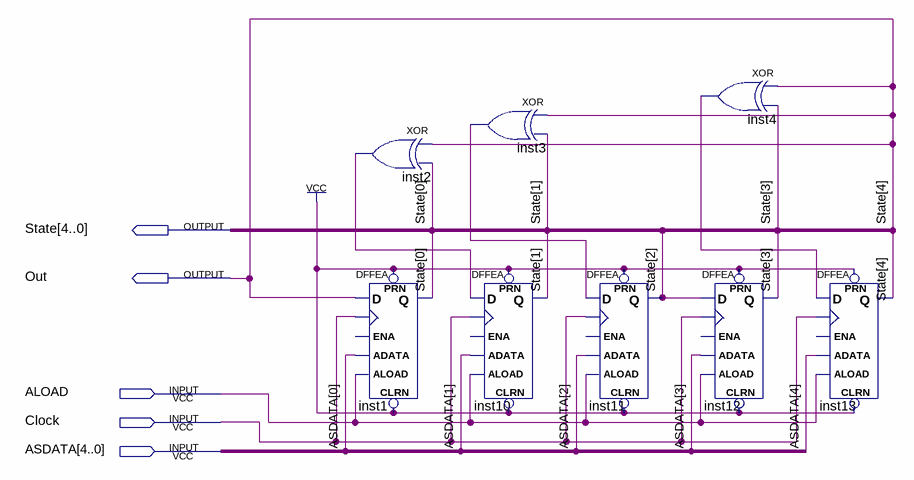
[diagram p0: schematic sheet]
// Quartus schematic MGeneratorInConnect.bdf as structural Verilog: 8 symbols, 5 pins
module MGeneratorInConnect (
  input  ALOAD,
  input  Clock,
  input  [4:0] ASDATA,
  output [4:0] State,
  output Out
);

  wire inst2_out, inst3_out, inst4_out;

  xor inst2 (inst2_out, Out, State[0]);
  DFFEA inst1 (
    .PRN(1'b1), .ALOAD(ALOAD), .ADATA(ASDATA[0]), .CLK(Clock), .D(Out), .CLRN(1'b1), .Q(State[0]));  // open: ENA
  xor inst3 (inst3_out, Out, State[1]);
  DFFEA inst10 (
    .PRN(1'b1), .ALOAD(ALOAD), .ADATA(ASDATA[1]), .CLK(Clock), .D(inst2_out), .CLRN(1'b1), .Q(State[1]));  // open: ENA
  DFFEA inst11 (
    .PRN(1'b1), .ALOAD(ALOAD), .ADATA(ASDATA[2]), .CLK(Clock), .D(inst3_out), .CLRN(1'b1), .Q(State[2]));  // open: ENA
  xor inst4 (inst4_out, Out, State[3]);
  DFFEA inst12 (
    .PRN(1'b1), .ALOAD(ALOAD), .ADATA(ASDATA[3]), .CLK(Clock), .D(State[2]), .CLRN(1'b1), .Q(State[3]));  // open: ENA
  DFFEA inst13 (
    .PRN(1'b1), .ALOAD(ALOAD), .ADATA(ASDATA[4]), .CLK(Clock), .D(inst4_out), .CLRN(1'b1), .Q(Out));  // open: ENA

  assign State[4] = Out;
endmodule
